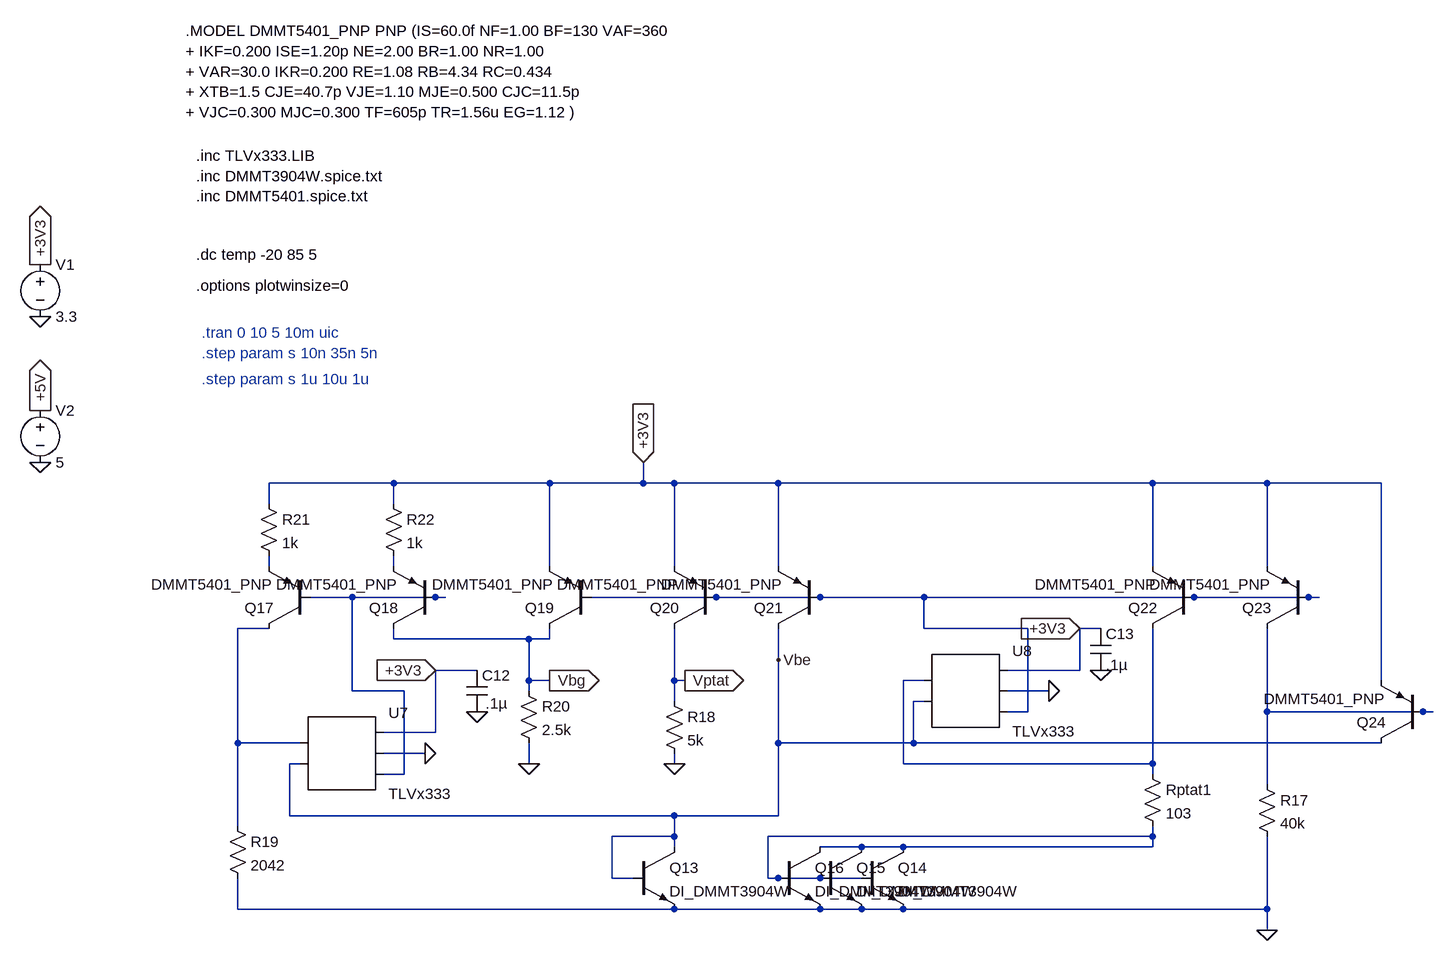
[diagram p0: schematic Capstone_BG_Ptat.asc]
Capstone_BG_Ptat.asc, the LTspice schematic file:
Version 4
SHEET 1 2676 2336
WIRE 768 160 576 160
WIRE 1008 160 768 160
WIRE 1152 160 1152 128
WIRE 1152 160 1008 160
WIRE 1200 160 1152 160
WIRE 1360 160 1200 160
WIRE 1936 160 1360 160
WIRE 2112 160 1936 160
WIRE 2288 160 2112 160
WIRE 576 192 576 160
WIRE 768 192 768 160
WIRE 576 288 576 272
WIRE 768 288 768 272
WIRE 1008 288 1008 160
WIRE 1200 288 1200 160
WIRE 1360 288 1360 160
WIRE 1936 288 1936 160
WIRE 2112 288 2112 160
WIRE 704 336 640 336
WIRE 832 336 704 336
WIRE 848 336 832 336
WIRE 1264 336 1072 336
WIRE 1424 336 1264 336
WIRE 1584 336 1424 336
WIRE 2000 336 1584 336
WIRE 2176 336 2000 336
WIRE 2192 336 2176 336
WIRE 576 384 528 384
WIRE 1584 384 1584 336
WIRE 1744 384 1584 384
WIRE 1856 384 1824 384
WIRE 768 400 768 384
WIRE 976 400 768 400
WIRE 1008 400 1008 384
WIRE 1008 400 976 400
WIRE 1360 432 1360 384
WIRE 896 448 832 448
WIRE 1824 448 1824 384
WIRE 1824 448 1712 448
WIRE 976 464 976 400
WIRE 1008 464 976 464
WIRE 1200 464 1200 384
WIRE 1216 464 1200 464
WIRE 1584 464 1552 464
WIRE 2288 464 2288 160
WIRE 704 480 704 336
WIRE 784 480 704 480
WIRE 976 480 976 464
WIRE 1776 480 1712 480
WIRE 1200 496 1200 464
WIRE 1584 496 1568 496
WIRE 1744 512 1744 384
WIRE 1744 512 1712 512
WIRE 2112 512 2112 384
WIRE 2352 512 2112 512
WIRE 2368 512 2352 512
WIRE 832 544 832 448
WIRE 832 544 752 544
WIRE 528 560 528 384
WIRE 624 560 528 560
WIRE 1360 560 1360 432
WIRE 1568 560 1568 496
WIRE 1568 560 1360 560
WIRE 2288 560 1568 560
WIRE 816 576 752 576
WIRE 624 592 608 592
WIRE 976 592 976 560
WIRE 1200 592 1200 576
WIRE 1552 592 1552 464
WIRE 1936 592 1936 384
WIRE 1936 592 1552 592
WIRE 784 608 784 480
WIRE 784 608 752 608
WIRE 1936 608 1936 592
WIRE 2112 624 2112 512
WIRE 608 672 608 592
WIRE 1200 672 608 672
WIRE 1360 672 1360 560
WIRE 1360 672 1200 672
WIRE 528 688 528 560
WIRE 1200 704 1200 672
WIRE 1200 704 1104 704
WIRE 1936 704 1936 688
WIRE 1936 704 1344 704
WIRE 1200 720 1200 704
WIRE 1488 720 1424 720
WIRE 1552 720 1488 720
WIRE 1936 720 1936 704
WIRE 1936 720 1552 720
WIRE 1104 768 1104 704
WIRE 1136 768 1104 768
WIRE 1344 768 1344 704
WIRE 1360 768 1344 768
WIRE 1424 768 1360 768
WIRE 1488 768 1424 768
WIRE 528 816 528 768
WIRE 1200 816 528 816
WIRE 1424 816 1200 816
WIRE 1488 816 1424 816
WIRE 1552 816 1488 816
WIRE 2112 816 2112 704
WIRE 2112 816 1552 816
WIRE 2112 848 2112 816
FLAG 224 128 0
FLAG 224 48 +5V
IOPIN 224 48 Out
FLAG 224 -96 0
FLAG 224 -176 +3V3
IOPIN 224 -176 Out
FLAG 2112 848 0
FLAG 1216 464 Vptat
IOPIN 1216 464 Out
FLAG 1200 592 0
FLAG 1360 432 Vbe
FLAG 976 592 0
FLAG 1008 464 Vbg
IOPIN 1008 464 Out
FLAG 896 512 0
FLAG 832 448 +3V3
IOPIN 832 448 In
FLAG 816 576 0
FLAG 1856 448 0
FLAG 1824 384 +3V3
IOPIN 1824 384 In
FLAG 1776 480 0
FLAG 1152 128 +3V3
IOPIN 1152 128 In
SYMBOL Voltage 224 32 R0
SYMATTR InstName V2
SYMATTR Value 5
SYMBOL Voltage 224 -192 R0
SYMATTR InstName V1
SYMATTR Value 3.3
SYMBOL Res 1920 592 R0
SYMATTR InstName Rptat1
SYMATTR Value 103
SYMBOL Res 2096 608 R0
SYMATTR InstName R17
SYMATTR Value 40k
SYMBOL Res 1184 480 R0
SYMATTR InstName R18
SYMATTR Value 5k
SYMBOL Res 512 672 R0
SYMATTR InstName R19
SYMATTR Value 2042
SYMBOL Res 960 464 R0
SYMATTR InstName R20
SYMATTR Value 2.5k
SYMBOL Res 560 176 R0
SYMATTR InstName R21
SYMATTR Value 1k
SYMBOL Res 752 176 R0
SYMATTR InstName R22
SYMATTR Value 1k
SYMBOL npn 1136 720 R0
SYMATTR InstName Q13
SYMATTR Value DI_DMMT3904W
SYMBOL npn 1488 720 R0
SYMATTR InstName Q14
SYMATTR Value DI_DMMT3904W
SYMBOL npn 1424 720 R0
SYMATTR InstName Q15
SYMATTR Value DI_DMMT3904W
SYMBOL npn 1360 720 R0
SYMATTR InstName Q16
SYMATTR Value DI_DMMT3904W
SYMBOL pnp 640 384 R180
SYMATTR InstName Q17
SYMATTR Value DMMT5401_PNP
SYMBOL pnp 832 384 R180
SYMATTR InstName Q18
SYMATTR Value DMMT5401_PNP
SYMBOL pnp 1072 384 R180
SYMATTR InstName Q19
SYMATTR Value DMMT5401_PNP
SYMBOL pnp 1264 384 R180
SYMATTR InstName Q20
SYMATTR Value DMMT5401_PNP
SYMBOL pnp 1424 384 R180
SYMATTR InstName Q21
SYMATTR Value DMMT5401_PNP
SYMBOL pnp 2000 384 R180
SYMATTR InstName Q22
SYMATTR Value DMMT5401_PNP
SYMBOL pnp 2176 384 R180
SYMATTR InstName Q23
SYMATTR Value DMMT5401_PNP
SYMBOL pnp 2352 560 R180
SYMATTR InstName Q24
SYMATTR Value DMMT5401_PNP
SYMBOL AutoGenerated/TLVx333 688 576 R0
SYMATTR InstName U7
SYMBOL AutoGenerated/TLVx333 1648 480 R0
SYMATTR InstName U8
SYMBOL Cap 880 448 R0
WINDOW 3 29 51 Left 2
SYMATTR Value .1µ
SYMATTR InstName C12
SYMBOL Cap 1840 384 R0
SYMATTR InstName C13
SYMATTR Value .1µ
TEXT 464 -344 Left 2 !.inc TLVx333.LIB\n.inc DMMT3904W.spice.txt\n.inc DMMT5401.spice.txt
TEXT 472 -72 Left 2 ;.tran 0 10 5 10m uic
TEXT 464 -144 Left 2 !.options plotwinsize=0
TEXT 472 -40 Left 2 ;.step param s 10n 35n 5n
TEXT 472 0 Left 2 ;.step param s 1u 10u 1u
TEXT 464 -192 Left 2 !.dc temp -20 85 5
TEXT 448 -536 Left 2 !.MODEL DMMT5401_PNP PNP (IS=60.0f NF=1.00 BF=130 VAF=360 \n+ IKF=0.200 ISE=1.20p NE=2.00 BR=1.00 NR=1.00 \n+ VAR=30.0 IKR=0.200 RE=1.08 RB=4.34 RC=0.434 \n+ XTB=1.5 CJE=40.7p VJE=1.10 MJE=0.500 CJC=11.5p \n+ VJC=0.300 MJC=0.300 TF=605p TR=1.56u EG=1.12 )

The netlist it stands for:
* Capstone_BG_Ptat.asc
V2 +5V 0 5
V1 +3V3 0 3.3
Rptat1 N006 N008 103
R17 N007 0 40k
R18 Vptat 0 5k
R19 N005 0 2042
R20 Vbg 0 2.5k
R21 +3V3 N001 1k
R22 +3V3 N002 1k
Q13 Vbe Vbe 0 0 DI_DMMT3904W
Q14 N008 N008 0 0 DI_DMMT3904W
Q15 N008 N008 0 0 DI_DMMT3904W
Q16 N008 N008 0 0 DI_DMMT3904W
Q17 N005 N003 N001 0 DMMT5401_PNP
Q18 Vbg N003 N002 0 DMMT5401_PNP
Q19 Vbg N004 +3V3 0 DMMT5401_PNP
Q20 Vptat N004 +3V3 0 DMMT5401_PNP
Q21 Vbe N004 +3V3 0 DMMT5401_PNP
Q22 N006 N004 +3V3 0 DMMT5401_PNP
Q23 N007 N004 +3V3 0 DMMT5401_PNP
Q24 Vbe N007 +3V3 0 DMMT5401_PNP
* U7: TLVx333 (symbol AutoGenerated/TLVx333 not available, pins judged from their places): pin1=N005 pin2=Vbe pin3=+3V3 pin4=0 pin5=N003
* U8: TLVx333 (symbol AutoGenerated/TLVx333 not available, pins judged from their places): pin1=N006 pin2=Vbe pin3=+3V3 pin4=0 pin5=N004
C12 +3V3 0 .1µ
C13 +3V3 0 .1µ
.model NPN NPN
.model PNP PNP
.lib standard.bjt
.inc TLVx333.LIB
.inc DMMT3904W.spice.txt
.inc DMMT5401.spice.txt
* .tran 0 10 5 10m uic
.options plotwinsize=0
* .step param s 10n 35n 5n
* .step param s 1u 10u 1u
.dc temp -20 85 5
.MODEL DMMT5401_PNP PNP (IS=60.0f NF=1.00 BF=130 VAF=360
+ IKF=0.200 ISE=1.20p NE=2.00 BR=1.00 NR=1.00
+ VAR=30.0 IKR=0.200 RE=1.08 RB=4.34 RC=0.434
+ XTB=1.5 CJE=40.7p VJE=1.10 MJE=0.500 CJC=11.5p
+ VJC=0.300 MJC=0.300 TF=605p TR=1.56u EG=1.12 )
.backanno
.end